# Altium schematic sheet RS485_IF.SchDoc: {Наименование}
size 420 x 297 mm; ApprovedBy: {Утвердил}; CheckedBy: {Проверил}; DrawnBy: {Разраб.}; DocumentNumber: АБВГ 123456.789 00; SheetNumber: 7; SheetTotal: {}; Scale: {Мш.}; PageSetup: Record=PageOptions|CenterHorizontal=False|CenterVertical=False|PrintScale=0.95|XCorrection=0.00|YCorrection=0.00|PrintKind=1|BorderSize=5000000|LeftOffset=0|BottomOffset=0|Orientation=1|PaperLength=1000|PaperWidth=1000|Scale=100|PaperSource=15|PrintQuality=600|MediaType=1|DitherType=10|PaperKind=A4|PrintScaleMode=1; ProcessInspection: {Т.контр.}; Mass: {М.}; NormInspection: {Н.контр.}; Letter1Column: {}; Letter2Column: {}; Letter3Column: {}; DocumentType: {Документ}; Rule: PcbType=ProtelPcb
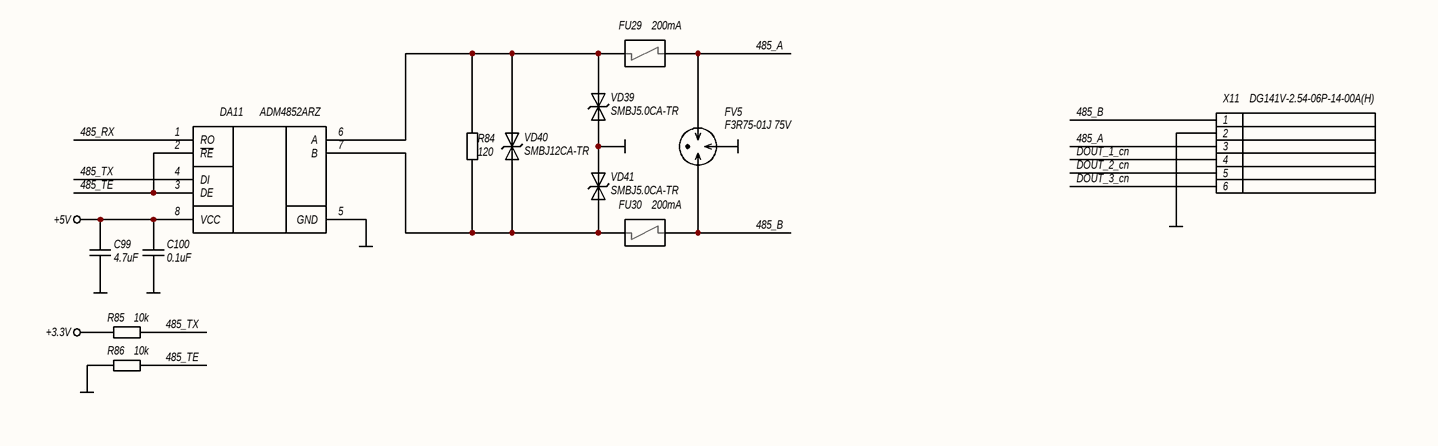
[diagram p0: RS485_IF.SchDoc]

## Parts
C99  4.7uF  [C0603N]
C100  0.1uF  [C0603N]
DA11  ADM4852ARZ  [SOIC8]
FU29  200mA  [TBU-CA]
FU30  200mA  [TBU-CA]
FV5  F3R75-01J 75V  [GDT_3PIN_B2]
R84  120  [R0805N]
R85  10k  [R0603N]
R86  10k  [R0603N]
VD39  SMBJ5.0CA-TR  [SMB]
VD40  SMBJ12CA-TR  [SMB]
VD41  SMBJ5.0CA-TR  [SMB]
X11  DG141V-2.54-06P-14-00A(H)  [DG141V-2.54-06P-14-00A(H)]

## Nets
+3.3V: R85.2
+5V: C99.2 C100.2 DA11.8(VCC)
GND: C99.1 C100.1 DA11.5(GND) FV5.2 R86.2 VD39.2(A2) VD41.2(A2) X11.2
485_A: FU29.3(IN/OUT) FV5.3 X11.3
485_B: FU30.3(IN/OUT) FV5.1 X11.1
485_RX: DA11.1(RO)
485_TE: DA11.2(~{RE}) DA11.3(DE) R86.1
485_TX: DA11.4(DI) R85.1
DOUT_1_cn: X11.4
DOUT_2_cn: X11.5
DOUT_3_cn: X11.6
NetDA11_6: DA11.6(A) FU29.1(IN/OUT) R84.2 VD39.1(A1) VD40.2(A2)
NetDA11_7: DA11.7(B) FU30.1(IN/OUT) R84.1 VD40.1(A1) VD41.1(A1)

## Notes on the sheet
- Подп. и дата
- Инв. № дубл.
- Взам. инв. №
- Инв. № подл.
- Лист
- Изм.
- № докум.
- Подп.
- Дата
- Копировал
- Формат А3

## Library data of the parts
C99 = CL10A475KO8NNNC: Конденсатор; Точность: 10%; Напряжение: 16V; Диэлектрик: X5R; Производитель: Samsung Electro-Mechanics; Описание: 4.7 µF ±10% 16V Ceramic Capacitor X5R 0603 (1608 Metric); Корпус: 0603 (1608 Metric); Температурный диапазон: -55°C ~ 85°C; Вид монтажа: SMD; Артикул: CL10A475KO8NNNC; Номинал: 4.7uF; Строка для документации: https://mm.digikey.com/Volume0/opasdata/d220001/medias/docus/2328/CL10A475KO8NNNC_Spec.pdf; Тип элемента: Конденсатор
C100 = CL10B104KB8NNNC: Конденсатор; Точность: 10%; Напряжение: 50V; Диэлектрик: X7R; Производитель: Samsung Electro-Mechanics; Описание: 0.1 µF ±10% 50V Ceramic Capacitor X7R 0603 (1608 Metric); Корпус: 0603 (1608 Metric); Температурный диапазон: -55°C ~ 125°C; Вид монтажа: SMD; Артикул: CL10B104KB8NNNC; Номинал: 0.1uF; Строка для документации: https://mm.digikey.com/Volume0/opasdata/d220001/medias/docus/609/CL10B104KB8NNNC_Spec.pdf; Тип элемента: Конденсатор
DA11 = ADM4852ARZ: Микросхема интерфейса RS485; Производитель: "D:\Altium\Libraries\GOST_LIBS\Libraries\IC\Analog Devices\ADM4852A.SchLib"; Описание: 1/1 Transceiver Half RS422, RS485 8-SOIC; Корпус: 8-SOIC (0.154", 3.90mm Width); Температурный диапазон: -40°C ~ 85°C; Вид монтажа: SMD; Артикул: ADM4852ARZ; Строка для документации: https://www.analog.com/media/en/technical-documentation/data-sheets/ADM4850_4851_4852_4853_4854_4855_4856_4857.pdf; Тип элемента: Микросхема
FU29 FU30 = TBU-CA065-200-WH: Полупроводниковый предохранитель; Напряжение: 650V; Тип: Surge Suppression IС; Производитель: Bourns Inc.; Описание: SURGE SUPP TBU 200MA 650VIMP SMD; Корпус: 6.50mm x 4.00mm; Температурный диапазон: -55°C ~ 125°C; Вид монтажа: SMD; Артикул: TBU-CA065-200-WH; Ток: 200mA; Строка для документации: https://www.bourns.com/docs/Product-Datasheets/TBU-CA.pdf; Тип элемента: Предохранитель
FV5 = F3R75-01J 75V: Газовый разрядник, трехвыводный; Ток: 10kA; Тип: Gas Discharge Tube Arresters (GDT); Производитель: ZF; Описание: Gas Discharge Tube 75 V 10000A (10kA) ±25% 3 Pole Through Hole Mount; Корпус: 11.5mm x 7.5mm dia.; Вид монтажа: Through hole; Артикул: F3R75-01J 75V; Напряжение пробоя: 75V; Строка для документации: http://nbruitian.com/show.asp?id=1412; Тип элемента: Газовый разрядник
R84 = RC0805FR-07120RL: Резистор; Точность: 1%; ТКС: ±100ppm/°C; Напряжение: 150V; Производитель: YAGEO; Описание: 120 Ohms ±1% 0.125W, 1/8W Chip Resistor 0805 (2012 Metric) Moisture Resistant Thick Film; Корпус: 0805 (2012 Metric); Температурный диапазон: -55°C ~ 155°C; Вид монтажа: SMD; Артикул: RC0805FR-07120RL; Номинал: 120; Строка для документации: https://www.yageo.com/upload/media/product/productsearch/datasheet/rchip/PYu-RC_Group_51_RoHS_L_12.pdf; Тип элемента: Резистор
R85 R86 = RC0603FR-0710KL: Резистор; Точность: 1%; ТКС: ±100ppm/°C; Напряжение: 75V; Производитель: YAGEO; Описание: 10 kOhms ±1% 0.1W, 1/10W Chip Resistor 0603 (1608 Metric) Moisture Resistant Thick Film; Корпус: 0603 (1608 Metric); Температурный диапазон: -55°C ~ 155°C; Вид монтажа: SMD; Артикул: RC0603FR-0710KL; Номинал: 10k; Строка для документации: https://www.yageo.com/upload/media/product/app/datasheet/rchip/pyu-rc_group_51_rohs_l.pdf; Тип элемента: Резистор
VD39 VD41 = SMBJ5.0CA-TR: TVS диод двунаправленный; Напряжение: 5V; Напряжение ограничения: 9.2V; Напряжение пробоя: 6.4V; Ток: 68A; Тип: TVS Bidirectional; Производитель: STMicroelectronics; Описание: 9.2V Clamp 68A Ipp Tvs Diode Surface Mount SMB (DO-214AA); Корпус: DO-214AA, SMB; Температурный диапазон: -55°C ~ 150°C (TJ); Вид монтажа: SMD; Тип элемента: Диод защитный; Артикул: SMBJ5.0CA-TR; Строка для документации: https://www.st.com/content/ccc/resource/technical/document/datasheet/19/78/91/39/07/cd/40/65/CD00001366.pdf/files/CD00001366.pdf/_jcr_content/translations/en.CD00001366.pdf
VD40 = SMBJ12CA-TR: TVS диод двунаправленный; Напряжение: 12V; Напряжение ограничения: 19.9V; Напряжение пробоя: 13.3V; Ток: 31A; Тип: TVS Bidirectional; Производитель: STMicroelectronics; Описание: 19.9V Clamp 31A Ipp Tvs Diode Surface Mount SMB (DO-214AA); Корпус: DO-214AA, SMB; Температурный диапазон: -55°C ~ 150°C (TJ); Вид монтажа: SMD; Тип элемента: Диод защитный; Артикул: SMBJ12CA-TR; Строка для документации: https://www.st.com/content/ccc/resource/technical/document/datasheet/19/78/91/39/07/cd/40/65/CD00001366.pdf/files/CD00001366.pdf/_jcr_content/translations/en.CD00001366.pdf
X11 = DG141V-2.54-06P-14-00A(H): Разъем, 6 контактов; Тип разъема: Push-Button terminal block; Количество контактов: 6; Шаг контактов: 2.54mm; Ток: 2A; Напряжение: 150V; Производитель: Degson Electronics; Описание: 6 Position Wire to Board Terminal Block Vertical with Board 0.100" (2.54mm) Through Hole; Температурный диапазон: -40°C ~ 105°C; Вид монтажа: Through Hole; Артикул: DG141V-2.54-06P-14-00A(H); Строка для документации: https://static.chipdip.ru/lib/874/DOC000874680.pdf; Тип элемента: Разъем